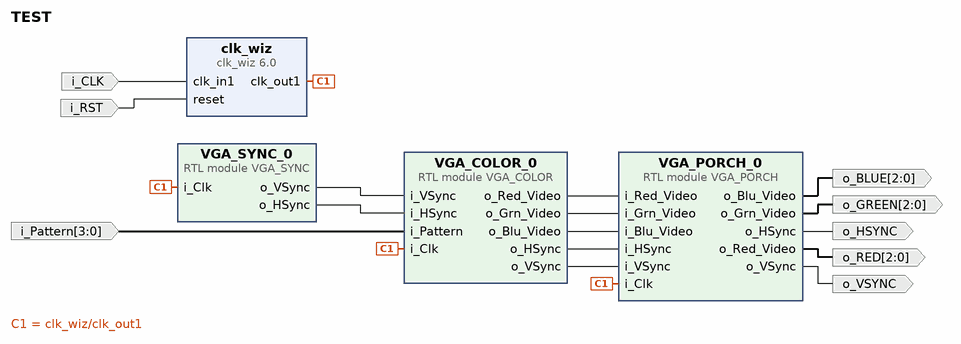
[diagram p0: block diagram of the top level]
# Vivado block design TEST, xc7z007sclg400-1, Vivado 2018.2
create_bd_design TEST

create_bd_port -dir O -from 2 -to 0 o_GREEN
create_bd_port -dir O -from 2 -to 0 o_RED
create_bd_port -dir O o_VSYNC
create_bd_port -dir O o_HSYNC
create_bd_port -dir O -from 2 -to 0 o_BLUE
create_bd_port -dir I -type clk i_CLK
set_property -dict {CONFIG.FREQ_HZ 100000000} [get_bd_ports i_CLK]
create_bd_port -dir I -type rst i_RST
set_property -dict {CONFIG.POLARITY ACTIVE_HIGH} [get_bd_ports i_RST]
create_bd_port -dir I -from 3 -to 0 i_Pattern

create_bd_cell -type module -reference VGA_PORCH VGA_PORCH_0
create_bd_cell -type module -reference VGA_SYNC VGA_SYNC_0
create_bd_cell -type module -reference VGA_COLOR VGA_COLOR_0
create_bd_cell -type ip -vlnv xilinx.com:ip:clk_wiz:6.0 clk_wiz
set_property -dict [list \
  CONFIG.CLKOUT1_REQUESTED_OUT_FREQ 25 \
  CONFIG.MMCM_DIVCLK_DIVIDE 1 \
  CONFIG.MMCM_CLKFBOUT_MULT_F 9.125 \
  CONFIG.MMCM_CLKOUT0_DIVIDE_F 36.500 \
  CONFIG.CLKOUT1_JITTER 181.828 \
  CONFIG.CLKOUT1_PHASE_ERROR 104.359 \
] [get_bd_cells clk_wiz]

# ---- connections ----

connect_bd_net [get_bd_pins VGA_COLOR_0/o_Red_Video] [get_bd_pins VGA_PORCH_0/i_Red_Video]
connect_bd_net [get_bd_pins VGA_COLOR_0/o_Grn_Video] [get_bd_pins VGA_PORCH_0/i_Grn_Video]
connect_bd_net [get_bd_pins VGA_COLOR_0/o_Blu_Video] [get_bd_pins VGA_PORCH_0/i_Blu_Video]
connect_bd_net [get_bd_pins VGA_SYNC_0/o_VSync] [get_bd_pins VGA_COLOR_0/i_VSync]
connect_bd_net [get_bd_pins VGA_SYNC_0/o_HSync] [get_bd_pins VGA_COLOR_0/i_HSync]
connect_bd_net [get_bd_pins VGA_COLOR_0/o_HSync] [get_bd_pins VGA_PORCH_0/i_HSync]
connect_bd_net [get_bd_pins VGA_COLOR_0/o_VSync] [get_bd_pins VGA_PORCH_0/i_VSync]
connect_bd_net [get_bd_pins clk_wiz/clk_out1] [get_bd_pins VGA_COLOR_0/i_Clk] [get_bd_pins VGA_SYNC_0/i_Clk] [get_bd_pins VGA_PORCH_0/i_Clk]
connect_bd_net [get_bd_pins VGA_PORCH_0/o_Grn_Video] [get_bd_ports o_GREEN]
connect_bd_net [get_bd_pins VGA_PORCH_0/o_Red_Video] [get_bd_ports o_RED]
connect_bd_net [get_bd_pins VGA_PORCH_0/o_VSync] [get_bd_ports o_VSYNC]
connect_bd_net [get_bd_pins VGA_PORCH_0/o_HSync] [get_bd_ports o_HSYNC]
connect_bd_net [get_bd_pins VGA_PORCH_0/o_Blu_Video] [get_bd_ports o_BLUE]
connect_bd_net -net clk_100MHz_1 [get_bd_ports i_CLK] [get_bd_pins clk_wiz/clk_in1]
connect_bd_net -net reset_rtl_0_1 [get_bd_ports i_RST] [get_bd_pins clk_wiz/reset]
connect_bd_net -net i_Pattern_0_1 [get_bd_ports i_Pattern] [get_bd_pins VGA_COLOR_0/i_Pattern]

validate_bd_design
save_bd_design
